# EAGLE board PDUv1 (EAGLE 9.6.2)
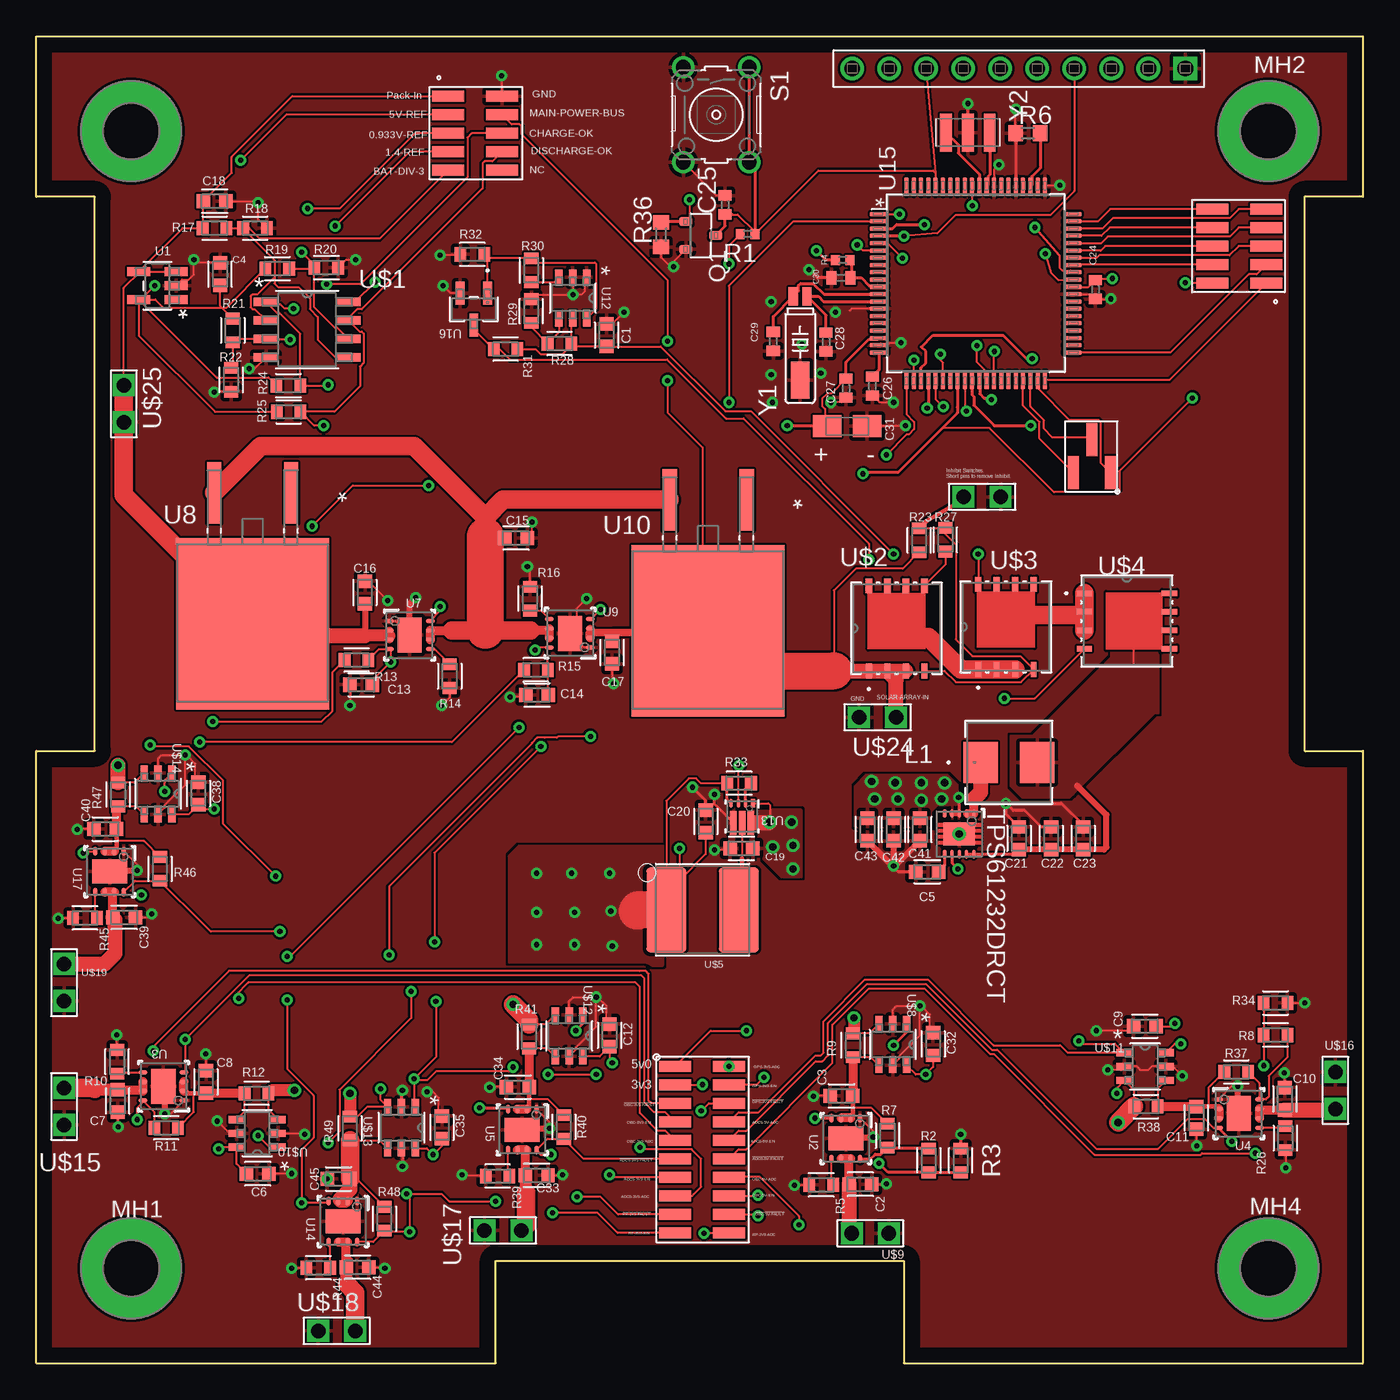
[diagram p4: board, top side]
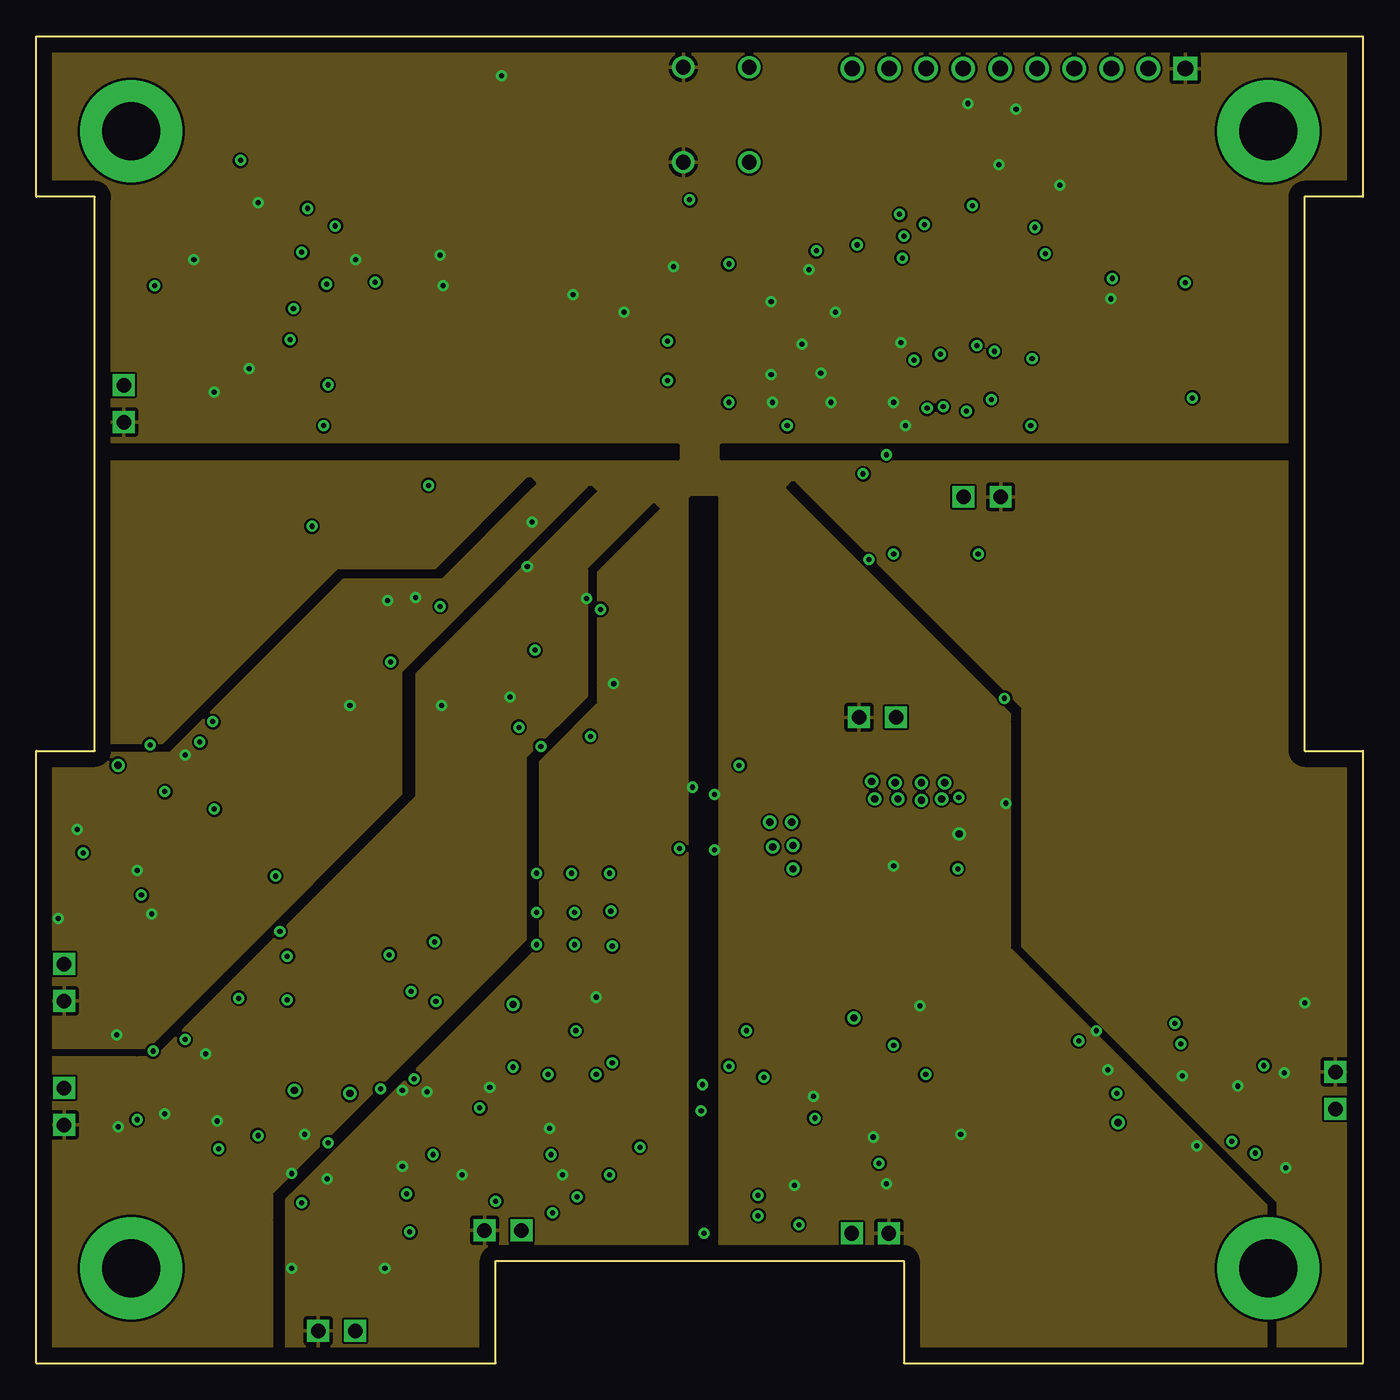
[diagram p5: board, inner layer GND]
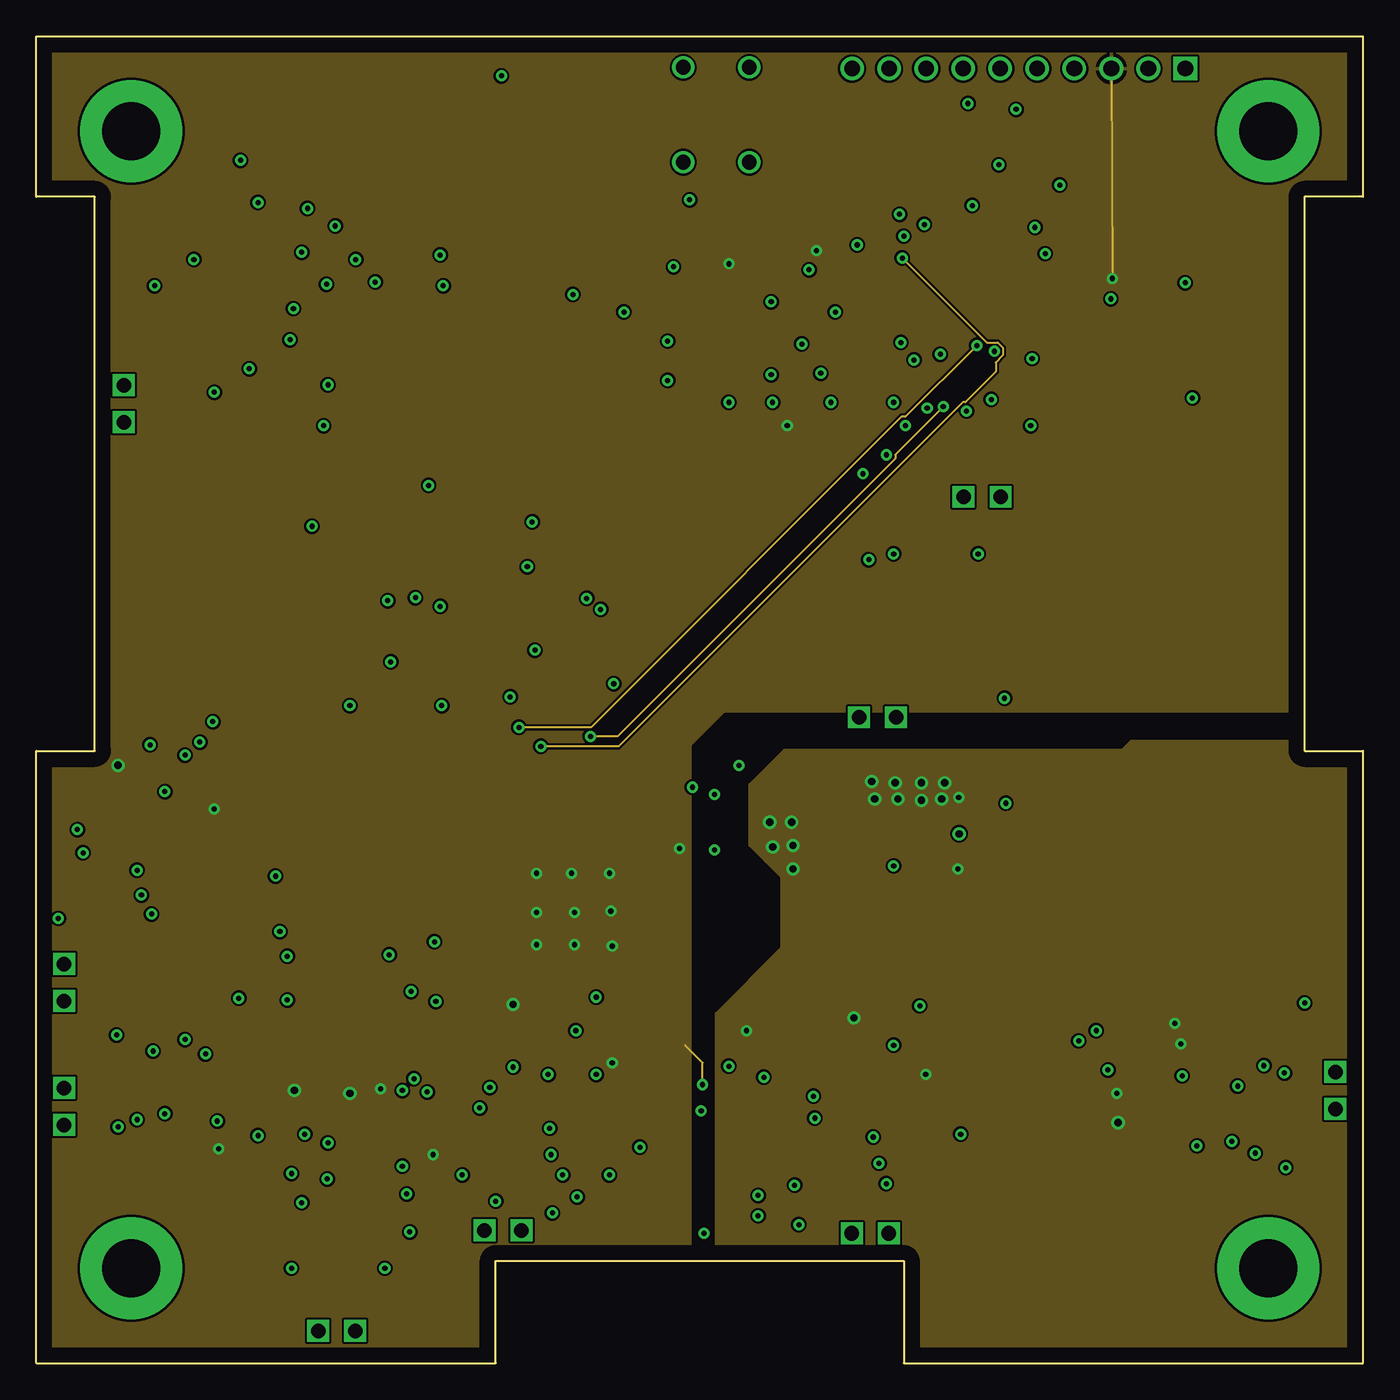
[diagram p6: board, inner layer POWER]
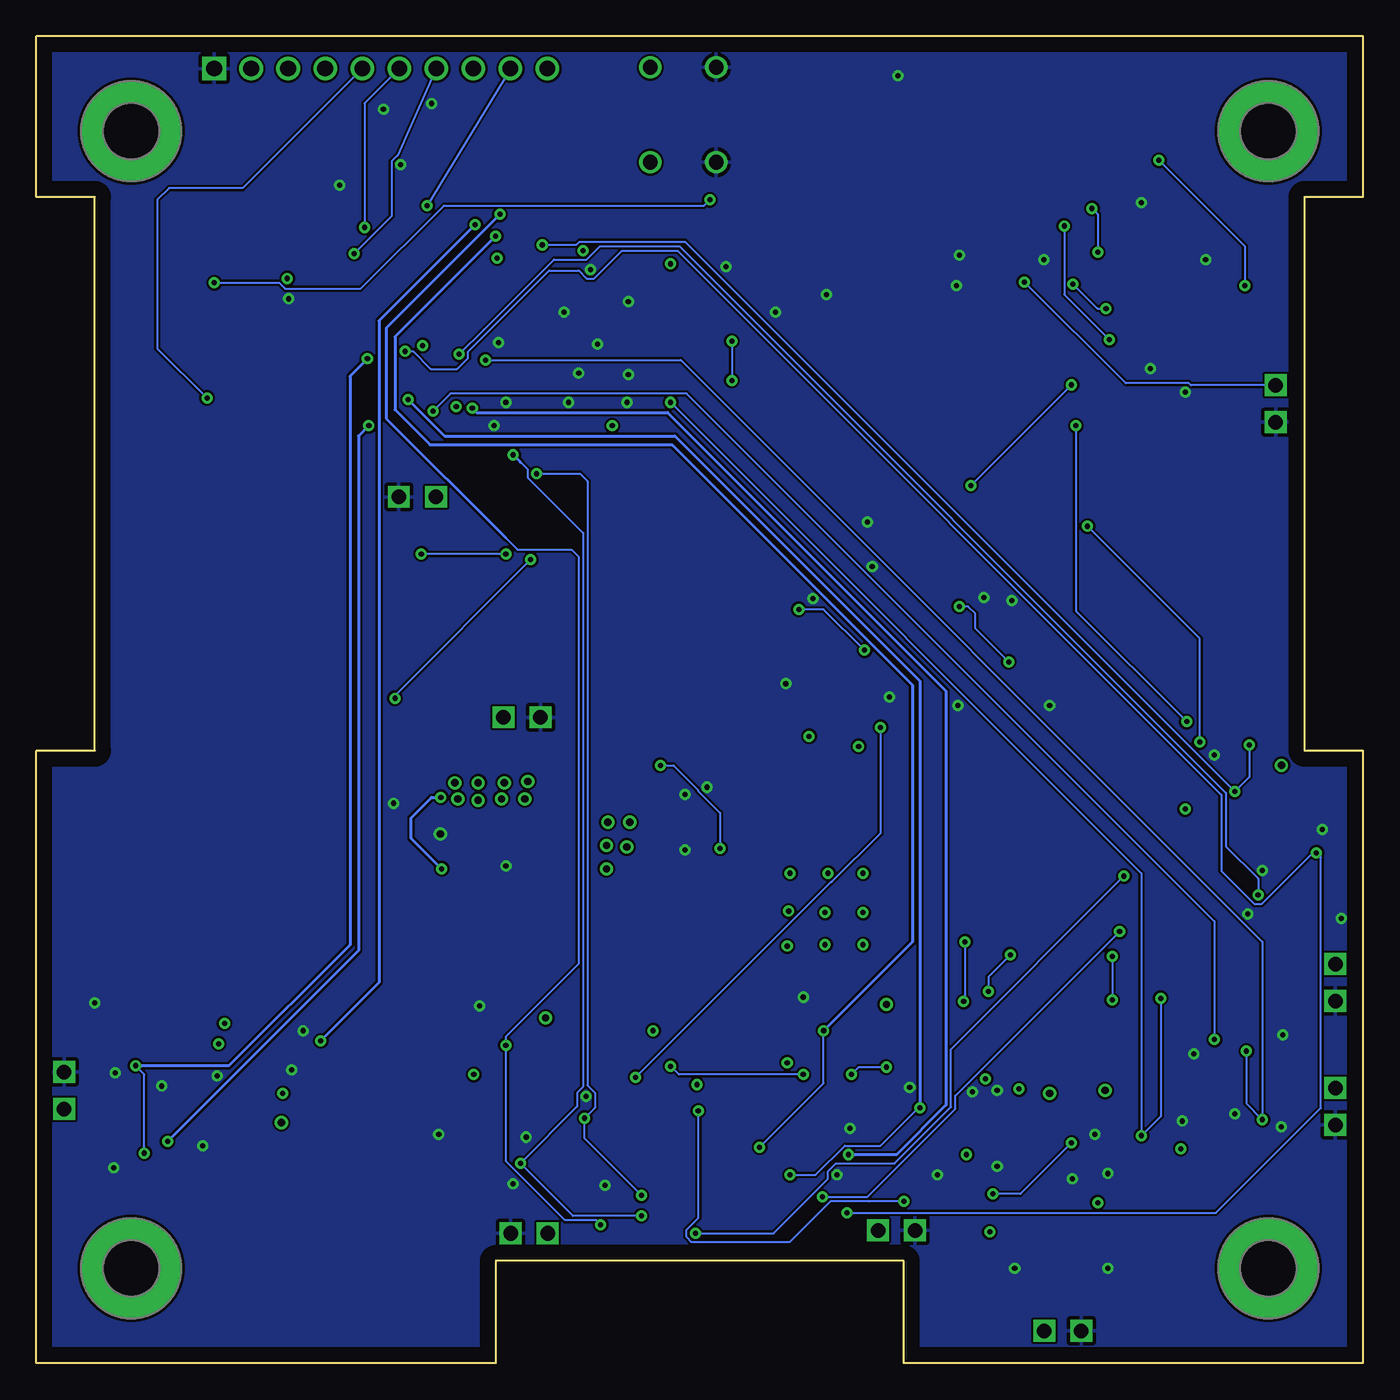
[diagram p7: board, bottom side, seen from below]

Size 91 x 91 mm. Coordinates in mm from the lower left corner, seen from the top.
Outline: 0,0 31.5,0 31.5,7 59.5,7 59.5,0 91,0 91,42 87,42 87,80 91,80 91,91 0,91 0,80 4,80 4,42 0,42 0,0
Copper layers (1+2*15+16): Top 0.035mm / dielectric 0.2mm / GND 0.035mm / dielectric 1mm / POWER 0.035mm / dielectric 0.2mm / Bottom 0.035mm
Design rules "default *": minimum track width 6mil, minimum drill 0.35mm, track to track 6mil, track to pad 6mil, pad to pad 6mil, via to via 6mil, smd to smd 6mil, copper to edge 40mil, drill to drill 6mil, minimum pad ring 10mil, minimum via ring 8mil, stop-mask expansion 4mil, vias tented up to drill 0mil, thermal gap 10mil
Net classes: 2 Power: width 0.203 mm, drill 0.305 mm, clearance 0.152 mm to class 0, clearance 0.152 mm to class 1, clearance 0.152 mm

## Footprints (pad centres in the part's own frame; a part is rotated, then mirrored left to right if it is on the bottom)
CAPC1608X85 = smd 0.921 x 0.97: 1 -0.775,0; 2 0.775,0
C0402 = smd 0.7 x 0.9: 1 -0.65,0; 2 0.65,0
A/3216-18R = smd 1.95 x 1.5: + 1.375,0; - -1.375,0
HDRV10W66P254_10X1_2540X254H858 = drill 1.08 pad 1.62 square: 1 0,0 | drill 1.08 pad 1.62: 2 2.54,0; 3 5.08,0; 4 7.62,0; 5 10.16,0; 6 12.7,0; 7 15.24,0; 8 17.78,0; 9 20.32,0; 10 22.86,0
IND_IHLP_2020_BZ_VIS-M = smd 2.362 x 2.794: 1 -1.943,0; 2 1.943,0
MTGP700H400 = drill 4 pad 7: 1 0,0
SOT23-3P95_230X110L20X43N_PMV16XN = smd 0.61 x 0.87: 1 -0.95,-1.02; 2 0.95,-1.02; 3 0,1.02
R0402 = smd 0.6 x 0.7: 1 -0.5,0; 2 0.5,0
RESC1608X60 = smd 0.799 x 0.974: 1 -0.815,0; 2 0.815,0
R0603 = smd 1 x 1.1: 1 -0.85,0; 2 0.85,0
B3F-10XX = drill 1.016: 1 -3.251,2.261; 2 3.251,2.261; 3 -3.251,-2.261; 4 3.251,-2.261
MF05A_TEX-M = smd 1.575 x 0.61: 1 -1.27,0.953; 2 -1.27,0; 3 -1.27,-0.953; 4 1.27,-0.953; 5 1.27,0.953
DRB0008B = smd 0.6 x 0.3: 1 -1.4,0.975; 2 -1.4,0.325; 3 -1.4,-0.325; 4 -1.4,-0.975; 5 1.4,-0.975; 6 1.4,-0.325; 7 1.4,0.325; 8 1.4,0.975 | smd 1.65 x 2.4: 9 0,0
D2PAK_STM-M = smd 0.991 x 4.216: 1 -2.64,-8.928; 3 2.64,-8.928 | smd 10.49 x 11.76: 2 0,0.051
DRC0010G = smd 0.6 x 0.24: 1 -1.4,1; 2 -1.4,0.5; 3 -1.4,0; 4 -1.4,-0.5; 5 -1.4,-1; 6 1.4,-1; 7 1.4,-0.5; 8 1.4,0; 9 1.4,0.5; 10 1.4,1 | smd 1.6 x 2.15: 11 0,0
TSOT-23_S6_LIT-M = smd 1.079 x 0.508: 1 -1.416,0.95; 2 -1.416,0; 3 -1.416,-0.95; 4 1.416,-0.95; 5 1.416,0; 6 1.416,0.95
RLT0007A = smd 0.6 x 0.25: 1 -0.9,0.75; 2 -0.9,0.25; 3 -0.9,-0.25; 4 -0.9,-0.75 | smd 1.64 x 0.44: 5 0.45,-0.6; 6 0.45,0; 7 0.45,0.6
QFP80P50_1400X1400X160L60X22N = smd 0.3 x 1.26: 1 -4.75,-6.63; 2 -4.25,-6.63; 3 -3.75,-6.63; 4 -3.25,-6.63; 5 -2.75,-6.63; 6 -2.25,-6.63; 7 -1.75,-6.63; 8 -1.25,-6.63; 9 -0.75,-6.63; 10 -0.25,-6.63; 11 0.25,-6.63; 12 0.75,-6.63; 13 1.25,-6.63; 14 1.75,-6.63; 15 2.25,-6.63; 16 2.75,-6.63; 17 3.25,-6.63; 18 3.75,-6.63; 19 4.25,-6.63; 20 4.75,-6.63; 41 4.75,6.63; 42 4.25,6.63; 43 3.75,6.63; 44 3.25,6.63; 45 2.75,6.63; 46 2.25,6.63; 47 1.75,6.63; 48 1.25,6.63; 49 0.75,6.63; 50 0.25,6.63; 51 -0.25,6.63; 52 -0.75,6.63; 53 -1.25,6.63; 54 -1.75,6.63; 55 -2.25,6.63; 56 -2.75,6.63; 57 -3.25,6.63; 58 -3.75,6.63; 59 -4.25,6.63; 60 -4.75,6.63 | smd 1.26 x 0.3: 21 6.63,-4.75; 22 6.63,-4.25; 23 6.63,-3.75; 24 6.63,-3.25; 25 6.63,-2.75; 26 6.63,-2.25; 27 6.63,-1.75; 28 6.63,-1.25; 29 6.63,-0.75; 30 6.63,-0.25; 31 6.63,0.25; 32 6.63,0.75; 33 6.63,1.25; 34 6.63,1.75; 35 6.63,2.25; 36 6.63,2.75; 37 6.63,3.25; 38 6.63,3.75; 39 6.63,4.25; 40 6.63,4.75; 61 -6.63,4.75; 62 -6.63,4.25; 63 -6.63,3.75; 64 -6.63,3.25; 65 -6.63,2.75; 66 -6.63,2.25; 67 -6.63,1.75; 68 -6.63,1.25; 69 -6.63,0.75; 70 -6.63,0.25; 71 -6.63,-0.25; 72 -6.63,-0.75; 73 -6.63,-1.25; 74 -6.63,-1.75; 75 -6.63,-2.25; 76 -6.63,-2.75; 77 -6.63,-3.25; 78 -6.63,-3.75; 79 -6.63,-4.25; 80 -6.63,-4.75
SOT-23_3L_ONS-M = smd 0.61 x 1.575: 1 -0.953,-1.092; 2 0.953,-1.092; 3 0,1.092
M08A-M = smd 1.664 x 0.559: 1 -2.826,1.905; 2 -2.826,0.635; 3 -2.826,-0.635; 4 -2.826,-1.905; 5 2.826,-1.905; 6 2.826,-0.635; 7 2.826,0.635; 8 2.826,1.905
MOSFET_65DP-T1-E3_VIS = smd 1.016 x 0.406: 1 -2.921,1.905; 2 -2.921,0.635; 3 -2.921,-0.635; 4 -2.921,-1.905; 5 2.921,-1.905; 6 2.921,-0.635; 7 2.921,0.635; 8 2.921,1.905
744040640047 = smd 2.76 x 5.83: 1 -2.485,0; 2 2.485,0
PREC002SAAN-RC = drill 1 square: 1 -1.27,0; 2 1.27,0
GRPB052VWQS-RC = smd 0.76 x 2.2: 1 0,0; 2 1.27,0; 3 2.54,0; 4 3.81,0; 5 5.08,0; 6 5.08,3.7; 7 3.81,3.7; 8 2.54,3.7; 9 1.27,3.7; 10 0,3.7
GRPB102VWQS-RC = smd 0.76 x 2.2: 1 0,0; 2 1.27,0; 3 2.54,0; 4 3.81,0; 5 5.08,0; 6 6.35,0; 7 7.62,0; 8 8.89,0; 9 10.16,0; 10 11.43,0; 11 11.43,3.7; 12 10.16,3.7; 13 8.89,3.7; 14 7.62,3.7; 15 6.35,3.7; 16 5.08,3.7; 17 3.81,3.7; 18 2.54,3.7; 19 1.27,3.7; 20 0,3.7
OBC-CON = smd 0.76 x 2.2: 1 0,0; 2 0,3.7; 3 1.27,0; 4 1.27,3.7; 5 2.54,0; 6 2.54,3.7; 7 3.81,0; 8 3.81,3.7; 9 5.08,0; 10 5.08,3.7
GRPB031VWTC-RC = smd 0.76 x 2.25: 1 0,0; 2 1.27,-2.25; 3 2.54,0
MS3V-T1R = smd 0.635 x 1.27: P1 -0.47,-4.43; P2 0.47,-4.43 | smd 1.27 x 2.54: P3 0,1.3
MURATA-FILTER_CSTCR = smd 0.8 x 2.6: 1 -1.5,0; 2 0,0; 3 1.5,0

## Placement (x,y rotation side)
C1  0.1u  [CAPC1608X85]  39.1,70.5 90 top
C2  47u  [CAPC1608X85]  56.52,12.27 0 top
C3  0.1u  [CAPC1608X85]  55.22,18.33 180 top
C4  0.022u  [CAPC1608X85]  12.6,74.7 270 top
C5  15n  [CAPC1608X85]  61.1,33.7 180 top
C6  0.1u  [CAPC1608X85]  15.18,12.99 0 top
C7  47u  [CAPC1608X85]  5.57,17.98 270 top
C8  0.1u  [CAPC1608X85]  11.63,19.28 90 top
C9  0.1u  [CAPC1608X85]  76.02,23.11 180 top
C10  47u  [CAPC1608X85]  85.63,18.12 90 top
C11  0.1u  [CAPC1608X85]  79.57,16.82 270 top
C12  0.1u  [CAPC1608X85]  39.31,22.48 90 top
C13  0.22u  [CAPC1608X85]  22.28,46.53 180 top
C14  0.22u  [CAPC1608X85]  34.33,45.83 180 top
C15  10u  [CAPC1608X85]  32.9,56.59 0 top
C16  0.1u  [CAPC1608X85]  22.53,52.86 90 top
C17  0.1u  [CAPC1608X85]  39.49,48.74 270 top
C18  1u  [CAPC1608X85]  12.22,79.69 0 top
C19  10u  [CAPC1608X85]  48.36,35.31 180 top
C20  10u  [CAPC1608X85]  45.91,37.16 90 top
C21  10u  [CAPC1608X85]  67.4,36 90 top
C22  10u  [CAPC1608X85]  69.6,36 90 top
C23  10u  [CAPC1608X85]  71.8,36 90 top
C24  100n  [C0402]  72.64,73.64 270 top
C25  1n  [C0402]  47.24,79.44 90 top
C26  470n  [C0402]  57.34,67.02 90 top
C27  100n  [C0402]  55.54,66.87 90 top
C28  12p  [C0402]  54.16,70.04 90 top
C29  12p  [C0402]  50.54,70.08 90 top
C30  100n  [C0402]  55.18,74.44 180 top
C31  10u  [A/3216-18R]  55.61,64.26 180 top
C32  0.1u  [CAPC1608X85]  61.51,21.88 90 top
C33  47u  [CAPC1608X85]  34.32,12.87 0 top
C34  0.1u  [CAPC1608X85]  33.02,18.93 180 top
C35  0.1u  [CAPC1608X85]  27.81,16.18 90 top
C38  0.1u  [CAPC1608X85]  11.11,39.08 90 top
C39  47u  [CAPC1608X85]  6.02,30.57 0 top
C40  0.1u  [CAPC1608X85]  4.72,36.63 180 top
C41  10u  [CAPC1608X85]  60.6,36.6 270 top
C42  10u  [CAPC1608X85]  58.8,36.6 270 top
C43  10u  [CAPC1608X85]  57,36.6 270 top
C44  47u  [CAPC1608X85]  22.02,6.57 0 top
C45  0.1u  [CAPC1608X85]  20.72,12.63 180 top
J5  HDR_10_EZFET_DEBUGGER  [HDRV10W66P254_10X1_2540X254H858]  78.81,88.8 180 top
L1  IHLP2020BZER1R0M01IND_IHLP_2020_BZ_VIS-M  [IND_IHLP_2020_BZ_VIS-M]  66.7,41.2 0 top
MH1  MTGP700H400  [MTGP700H400]  6.5,6.5 0 top
MH2  MTGP700H400  [MTGP700H400]  84.5,84.5 0 top
MH3  MTGP700H400  [MTGP700H400]  6.5,84.5 0 top
MH4  MTGP700H400  [MTGP700H400]  84.5,6.5 0 top
Q1  PMV16XN  [SOT23-3P95_230X110L20X43N_PMV16XN]  45.57,77.35 270 top
R1  47k  [R0402]  48.78,77.44 180 top
R2  100k  [RESC1608X60]  61.2,13.9 90 top
R3  196k  [RESC1608X60]  63.4,13.9 270 top
R4  0R  [R0402]  55.3,75.66 180 top
R5  54.9k  [RESC1608X60]  53.83,12.23 0 top
R6  1M  [R0603]  68.01,84.36 0 top
R7  100k  [RESC1608X60]  58.37,15.6 90 top
R8  100k  [RESC1608X60]  85,22.5 0 top
R9  40m  [RESC1608X60]  56,21.8 90 top
R10  54.9k  [RESC1608X60]  5.53,20.67 270 top
R11  100k  [RESC1608X60]  8.9,16.13 0 top
R12  40m  [RESC1608X60]  15.1,18.5 0 top
R13  100k  [RESC1608X60]  21.96,48.23 0 top
R14  20k  [RESC1608X60]  28.35,47.12 90 top
R15  100k  [RESC1608X60]  34.26,47.55 0 top
R16  20k  [RESC1608X60]  33.87,52.44 270 top
R17  340k  [RESC1608X60]  12.22,77.85 180 top
R18  169k  [RESC1608X60]  15,77.85 180 top
R19  1.62M  [RESC1608X60]  16.52,75.07 180 top
R20  374k  [RESC1608X60]  19.88,75.15 180 top
R21  1.43M  [RESC1608X60]  13.47,70.83 90 top
R22  562k  [RESC1608X60]  13.35,67.44 90 top
R23  499k  [RESC1608X60]  60.55,56.44 270 top
R24  332k  [RESC1608X60]  17.28,67.05 180 top
R25  332k  [RESC1608X60]  17.3,65.25 180 top
R26  54.9k  [RESC1608X60]  85.67,15.43 90 top
R27  499k  [RESC1608X60]  62.35,56.48 270 top
R28  1Meg  [RESC1608X60]  35.88,69.93 0 top
R29  392k  [RESC1608X60]  33.95,72.16 270 top
R30  715k  [RESC1608X60]  33.95,74.96 90 top
R31  499k  [RESC1608X60]  32.18,69.55 0 top
R32  100k  [RESC1608X60]  29.9,76.05 0 top
R33  1M  [RESC1608X60]  48.2,39.77 0 top
R34  196k  [RESC1608X60]  85,24.7 180 top
R36  10k  [R0603]  42.84,77.4 90 top
R37  100k  [RESC1608X60]  82.3,19.97 180 top
R38  40m  [RESC1608X60]  76.1,17.6 180 top
R39  54.9k  [RESC1608X60]  31.63,12.83 0 top
R40  100k  [RESC1608X60]  36.17,16.2 90 top
R41  40m  [RESC1608X60]  33.8,22.4 90 top
R44  54.9k  [RESC1608X60]  19.33,6.53 0 top
R45  54.9k  [RESC1608X60]  3.33,30.53 0 top
R46  100k  [RESC1608X60]  8.47,33.9 90 top
R47  40m  [RESC1608X60]  5.6,39 90 top
R48  100k  [RESC1608X60]  23.87,9.9 90 top
R49  40m  [RESC1608X60]  21.5,16.1 90 top
S1  RST  [B3F-10XX]  46.63,85.63 270 top
U1  LM4120IM5-5.0/NOPBMF05A_TEX-M  [MF05A_TEX-M]  8.3,73.9 180 top
U2  Value  [DRB0008B]  55.52,15.41 270 top
U3  Value  [DRB0008B]  8.71,18.98 180 top
U4  Value  [DRB0008B]  82.49,17.12 0 top
U5  Value  [DRB0008B]  33.32,16.01 270 top
U7  Value  [DRB0008B]  25.61,49.94 0 top
U8  STPS10L25G-TRD2PAK_STM-M  [D2PAK_STM-M]  14.83,50.77 180 top
U9  Value  [DRB0008B]  36.59,50.06 180 top
U10  STPS10L25G-TRD2PAK_STM-M  [D2PAK_STM-M]  46.07,50.29 180 top
U11  TPS61232DRCT  [DRC0010G]  63.3,36.3 270 top
U12  LTC6995IS6-1TRMPBFTSOT-23_S6_LIT-M  [TSOT-23_S6_LIT-M]  36.79,73.06 270 top
U13  TPS62086RLTR  [RLT0007A]  48.4,37.5 270 top
U14  Value  [DRB0008B]  21.02,9.71 270 top
U15  MSP430F5529IPN  [QFP80P50_1400X1400X160L60X22N]  64.43,74.07 270 top
U16  BSS138SOT-23_3L_ONS-M  [SOT-23_3L_ONS-M]  30,72.3 180 top
U17  Value  [DRB0008B]  5.02,33.71 270 top
U$1  LM393M  [M08A-M]  18.57,70.89 0 top
U$2  SI7461DP-T1-E3  [MOSFET_65DP-T1-E3_VIS]  59,50.4 90 top
U$3  SI7461DP-T1-E3  [MOSFET_65DP-T1-E3_VIS]  66.5,50.5 90 top
U$4  SI7461DP-T1-E3  [MOSFET_65DP-T1-E3_VIS]  74.8,50.9 0 top
U$5  744040640047  [744040640047]  45.69,31.09 0 top
U$7  PREC002SAAN-RC  [PREC002SAAN-RC]  64.87,59.42 0 top
U$8  INA181A2QDBVRQ1CT  [TSOT-23_S6_LIT-M]  58.74,21.85 270 top
U$9  PREC002SAAN-RC  [PREC002SAAN-RC]  57.2,8.9 180 top
U$10  INA181A2QDBVRQ1CT  [TSOT-23_S6_LIT-M]  15.15,15.76 180 top
U$11  INA181A2QDBVRQ1CT  [TSOT-23_S6_LIT-M]  76.05,20.34 0 top
U$12  INA181A2QDBVRQ1CT  [TSOT-23_S6_LIT-M]  36.54,22.45 270 top
U$13  INA181A2QDBVRQ1CT  [TSOT-23_S6_LIT-M]  25.04,16.15 270 top
U$14  INA181A2QDBVRQ1CT  [TSOT-23_S6_LIT-M]  8.34,39.05 270 top
U$15  PREC002SAAN-RC  [PREC002SAAN-RC]  1.9,17.6 90 top
U$16  PREC002SAAN-RC  [PREC002SAAN-RC]  89.1,18.7 270 top
U$17  PREC002SAAN-RC  [PREC002SAAN-RC]  32,9.1 0 top
U$18  PREC002SAAN-RC  [PREC002SAAN-RC]  20.6,2.2 0 top
U$19  PREC002SAAN-RC  [PREC002SAAN-RC]  1.9,26.1 90 top
U$20  GRPB052VWQS-RC  [GRPB052VWQS-RC]  28.24,86.9 270 top
U$21  GRPB102VWQS-RC  [GRPB102VWQS-RC]  43.8,20.36 270 top
U$22  OBC-CONNECTOR  [OBC-CON]  84.36,74.08 90 top
U$23  GRPB031VWTC-RC  [GRPB031VWTC-RC]  73.66,61.09 180 top
U$24  PREC002SAAN-RC  [PREC002SAAN-RC]  57.7,44.3 180 top
U$25  PREC002SAAN-RC  [PREC002SAAN-RC]  6,65.8 270 top
Y1  32.768kHz  [MS3V-T1R]  52.39,68.74 180 top
Y2  CSTCR4M00G15L99  [MURATA-FILTER_CSTCR]  63.89,84.41 0 top

## Tracks (layer width: path | path; a pad name or v marks a point on that pad's centre or on a via)
0.933V-REF  (via drill 0.35)
  Top 0.152: R19.1 18.98,75.07 R20.2 | U$20.3 25.96,84.36 20.8,79.2 v18.6,79.2 | v18.2,76.2 19.07,75.33 R20.2 | U$1.6 20.63,71.02 20.47,71.02 19.07,72.42 R20.2
  Bottom 0.152: v18.6,79.2 18.2,78.8 v18.2,76.2
1.4V-REF  (via drill 0.35)
  Top 0.152: R22.2 13.47,68.38 R21.1 13.71,70.25 U$1.3 15.8,70.2 v17.4,70.2 | U$20.4 25.59,83.09 v20.5,78
  Bottom 0.152: v20.5,78 20.5,73.3 v17.4,70.2
3V3  (via drill 0.35, 0.5)
  Top 0.152: C6.1 13.73,13.66 U$10.6 12.61,14.81 v12.5,14.7 | U$10.3 15.91,17.36 R12.2 | U$14.6 10.44,37.63 C38.1 11.41,38 v12.2,38 | U$14.3 6.74,39.81 R47.2 | U15.50 72.17,73.82 C24.1 72.75,74.4 v73.8,74.4 | v39.5,20.6 39.31,20.79 C12.1 38.64,21.03 U$12.6 | C20.1 45.91,34.91 44.1,33.1 | U13.3 48.15,40.95 v48.2,41 | v44.1,35.3 44.1,33.1 | 44.1,33.1 43.7,32.7 | R1.2 47.5,76.66 v47.5,75.4 | C27.2 54.53,66.51 54.25,66.51 53.89,66.15 53.89,65.65 54.1,65.44 54.1,64.26 | U$5.1 43.2,38.56 44.75,40.11 45.25,40.11 45.59,39.77 R33.1 | U$21.2 v45.69,19.09 v45.7,19.1 | v23.6,18.8 23.6,18.06 U$13.3 22.67,17.57 22.02,16.91 R49.2 | U$13.6 26.77,14.73 v27.2,14.3 27.81,14.91 C35.1 | U$12.3 34.94,23.21 R41.2
  Top 0.203: U15.18 57.7,70.22 57.11,70.22 55.54,68.65 C27.2 | C31.+ 54.1,64.26 51.54,64.26 v51.5,64.3 | R4.2 54.14,75.66 v53.5,76.3 | U13.4 47.38,38.66 R33.1
  Top 0.813: v17.7,18.7 16.11,18.7 R12.2 | v21.5,18.5 R49.2
  Top 1.016: R47.2 v5.6,41
  Top 1.27: R41.2 33.8,23.5 v32.7,24.6
  Top 2.54: U$5.1 41.29,31.09 41.2,31
  POWER 0.152: v45.7,19.1 45.7,20.6 44.5,21.8 | J5.3 v73.8,74.4
  Bottom 0.152: v48.2,41 47.3,41 45.61,39.31 45.61,39.25 44.1,37.74 v44.1,35.3
  other vias: 34.3,33.6 36.7,33.6 39.3,33.6 34.3,30.9 36.9,30.9 39.4,31 34.3,28.7 36.9,28.7 39.5,28.6
  pour Top (isolate 0.406): 43,35.5 43,27.3 42.9,27.2 32.7,27.2 32.4,27.5 32.4,34.8 33.1,35.5
  pour POWER: -0.6,91.7 -0.6,-0.5 -0.1,-1 44.8,-1 44.9,-0.9 44.9,42.4 45,42.5 47.2,44.7 52.3,44.7 91.4,44.7 91.4,91.6 91.5,91.7
3V3-ADCS
  Top 0.152: 33.55,14.51 U5.7 | 33.6,12.81 C33.1
  Top 0.61: U5.7 U5.6 | C33.1 33.55,14.51
  Top 0.813: C33.1 33.55,11.76 33.6,11.7
  Top 1.27: 33.6,11.7 33.6,9.43 U$17.2
3V3-GPS
  Top 0.152: 21.25,6.86 C44.1 21.34,6.67
  Top 0.61: U14.6 U14.7 21.25,8.21 C44.1
  Top 0.813: 21.25,6.86 21.34,6.95 | C44.1 21.25,5.46 21.3,5.4
  Top 1.27: 21.3,5.4 21.87,4.83 U$18.2
3V3-OBC
  Top 0.152: 7.21,18.75 U3.7 | 5.6,18.86 5.7,18.75
  Top 0.61: U3.7 U3.6 | C7.1 5.7,18.75 7.21,18.75 | 5.6,18.86 4.93,18.86
  Top 0.813: C7.1 4.04,18.75 4,18.8
  Top 1.27: 4,18.8 3.93,18.87 U$15.2
3V3-RF
  Top 0.152: 5.25,32.21 U17.7
  Top 0.61: U17.7 U17.6 | C39.1 5.25,32.21
  Top 1.016: U$19.2 4.67,27.37 5.4,28.1 5.4,30.41 C39.1
5V0  (via drill 0.35, 0.5)
  Top 0.152: U$8.3 57.14,22.61 R9.2 55.9,22.71 | R38.2 75.28,18.74 U$11.3 74.1,18.86 v74.1,18.5 | U$21.1 46.24,22.8 v48.7,22.8 | C9.1 77.91,23.11 v78.1,23.3 | v78.5,21.9 78.08,21.9 U$11.6 | C32.1 61.51,20.31 v61,19.8 60.32,19.8 U$8.6 | U13.1 50.2,38.4 50.3,38.3 v50.3,37.1
  Top 0.2: U11.7 62.8,34.3 v63.2,33.9 | v63.26,38.8 63.26,37.74 63.22,37.7
  Top 0.203: v50.3,37.1 50.25,37.05
  Top 0.406: 63.22,37.7 U11.4
  Top 0.813: v56.07,23.67 56.07,22.69 R9.2
  Top 1.016: 50.25,37.05 49.28,37.05
  Top 1.27: R38.2 74.2,16.52 v74.2,16.5
  Bottom 0.2: v63.2,33.9 65.3,36 65.3,37.4 63.9,38.8 v63.26,38.8
  other vias: 51.8,37.1 50.5,35.4 51.9,35.5 51.9,33.9 57.3,39.9 59.1,38.7 58.9,39.8 57.5,38.7 60.7,38.6 60.7,39.8 62.1,38.7 62.3,39.8
  pour Top (isolate 0.406): 50.4,37.9 49.1,37.9 48.8,37.6 48.8,36.2 48.4,35.8 48.2,35.8 48.1,35.7 48.1,34.6 49.8,34.6 51.1,33.3 52.5,33.3 52.5,37.9 52.4,38 50.5,38
  pour POWER (rank 2): 46.6,-0.4 46.6,24 51.1,28.5 51.1,33.3 50,34.4 48.9,35.5 48.9,38.1 48.9,39.7 51.3,42.1 74.5,42.1 75.1,42.7 91.7,42.7 91.7,0.2 90.8,-0.7 46.9,-0.7
  pour Top: 63.2,38.8 63.2,38.3 63.3,38.2 63.3,37.3 62.8,37.3 62.8,38.2 61.8,38.2 61.7,38.1 61.4,37.8 61.4,36.7 56.2,36.7 56.1,36.8 56.1,39.6 56.9,40.4 62.5,40.4 62.9,40 63.2,39.7
5V-ADCS
  Top 0.152: 83.99,17.34 U4.7
  Top 0.61: U4.7 U4.6 | C10.1 83.99,17.34
  Top 1.016: U$16.2 89.02,17.34 C10.1
5V-OBC
  Top 0.152: 55.74,13.91 U2.7
  Top 0.61: U2.7 U2.6 | C2.1 55.74,13.91
  Top 1.016: C2.1 55.74,9.09 U$9.2
5V-REF  (via drill 0.35)
  Top 0.152: U1.5 8.15,72.95 8.69,72.41 12.7,72.41 | 12.7,72.41 13.05,72.41 R19.2 | 12.7,72.41 R21.2 | 12.7,72.41 12.6,72.52 C4.2 | U1.5 12.38,67.6 15.91,67.6 R24.2 | U1.5 7.03,70.47 12.25,65.25 R25.2 | U$20.2 17.13,85.63 v14,82.5 | v8.1,73.9 7.15,72.95 U1.5
  Bottom 0.152: v14,82.5 8.1,76.6 v8.1,73.9
!ADCS-3V3-FAULT  (via drill 0.35)
  Top 0.152: U5.8 35.07,15.38 R40.1 37.55,14.01 U$21.6
  Top 0.2: U15.24 61.18,65.58 v61.1,65.5 | v35.3,14.3 34.6,14.3 U5.8
  Bottom 0.2: v61.1,65.5 60.8,65.2 47.7,65.2 28.6,46.1 28.6,17.7 32,14.3 v35.3,14.3
!ADCS-5V-FAULT  (via drill 0.35)
  Top 0.152: U$21.15 48.16,14.67 48.7,14.67 54.6,20.58 54.6,23.2 57.1,25.7 60.9,25.7 65.41,21.2 65.67,21.2 72.58,14.29 79.85,14.29 79.96,14.4 v83.6,14.4 | R34.2 R8.1 84.2,22.48 v84.2,20.4
  Top 0.2: U15.23 60.68,68.28 61,68.6 61,69.4 60.7,69.7 61.5,70.5 66.3,70.5 67.9,68.9 v68.3,68.9
  Bottom 0.152: v83.6,14.4 83.6,19.8 v84.2,20.4
  Bottom 0.2: v68.3,68.9 69.5,67.7 69.5,28.7 77.8,20.4 v84.2,20.4
!GPS-3V3-FAULT  (via drill 0.35)
  Top 0.152: R48.1 23.79,9 | 23.79,9 23.09,8.31 U14.8 | U15.25 61.68,66.12 v62.2,65.6 | 23.79,9 v25.6,9 25.6,11.4 v25.4,11.6 27.8,11.6 28.3,11.1 v31.5,11.1 | v45.6,17.3 46.12,17.82 U$21.18 | v38,42.99 35.79,42.99 35.7,42.9 34.86,42.9 34.85,42.91 34.35,42.91 33.99,42.55 33.99,42.49 24.2,32.7 v24.2,28 | v20,15.1 20.78,15.88 20.78,18.75 25.7,23.66 v25.7,25.49
  POWER 0.152: v62.2,65.6 58.91,62.31 58.91,62.05 39.85,42.99 v38,42.99
  Bottom 0.152: v24.2,28 25.7,26.5 v25.7,25.49 | v20,15.1 23.5,11.6 v25.4,11.6 | v31.5,11.1 33.87,11.1 33.89,11.09 36.54,11.09 39.33,8.29 46.05,8.29 46.41,8.65 46.41,9.15 45.6,9.96 v45.6,17.3
!OBC-3V3-FAULT  (via drill 0.35)
  Top 0.152: U3.8 7.36,17.96 | 7.36,17.96 8.09,17.23 R11.1 | U15.22 60.18,68.78 v60.2,68.8 | v6.9,16.7 6.9,17.5 7.36,17.96 | U$21.3 42.18,17.82 42,18 42,26.7 41.8,26.9 41.4,26.9 41.4,26.91 13.21,26.91 8,21.7 v8,21.4
  Bottom 0.152: v60.2,68.8 46.8,68.8 6.9,28.9 v6.9,16.7 8,17.8 v8,21.4
!OBC-5V-FAULT  (via drill 0.35)
  Top 0.152: U$21.12 49.4,10.2 v49.5,10.1 | U15.21 59.68,65.08 60.21,64.55 60.21,64.05 59.85,63.69 59.69,63.69 v58.3,62.3
  Top 0.2: v57.8,13.7 58.41,13.09 R2.1 R3.2
  Bottom 0.152: v49.5,10.1 54.2,10.1 v57.8,13.7 53.91,17.59 53.91,18.55 53.51,18.95 53.51,56.95 57.31,60.75 57.31,61.31 57.8,61.8
  Bottom 0.2: v58.3,62.3 57.8,61.8
!RF-3V3-FAULT  (via drill 0.35)
  Top 0.152: U15.26 62.18,68.62 62,68.8 v62,69.2 | v7.2,32.1 6.21,32.1 U17.8 6.77,33.09 R46.1 11.43,30.13 11.96,29.6 v16.7,29.6 | 43.7,10.1 U$21.9 39.9,10.2 38.71,11.39 v37.09,11.39
  Bottom 0.152: v62,69.2 60.3,70.9 55.51,75.69 53.25,75.69 52.34,76.6 46.9,76.6 9.41,39.11 9.41,35.45 7.2,33.24 v7.2,32.1 | v16.7,29.6 27.97,18.33 27.97,17.44 34.01,11.39 v37.09,11.39
ADCS-3V3-
  Top 0.152: U$12.4 35.04,21.59 R41.1 | C34.1 | 33.8,17.56 U5.2 | R40.2 35.09,18.1 33.8,18.1
  Top 0.305: C34.1 33.8,18.1 33.8,17.56
  Top 0.61: R41.1 C34.1 | U5.2 U5.3
ADCS-3V3-ADC  (via drill 0.35)
  Top 0.152: U$21.8 44.97,11.47 45.6,12.1 45.6,14.01 44.94,14.67 41.53,14.67 v41.4,14.8 | v59.5,77.3 61.8,77.5 63.04,78.74 69.54,78.74 71.19,80.39 J5.4
  Top 0.2: U15.4 59.48,77.32 v59.5,77.3 | v37,22.8 37.49,23.29 U$12.1
  Bottom 0.152: v41.4,14.8 37,19.2 v37,22.8
  Bottom 0.2: v59.5,77.3 66.4,70.4 66.4,65.4 64,63 47.4,63 30.9,46.5 30.9,28.9 v37,22.8
ADCS-3V3-EN  (via drill 0.35)
  Top 0.152: U$21.7 39.46,12.74 v39.3,12.9
  Top 0.2: U15.31 64.7,67.42 64.7,66.5 65,66.2 65.4,66.2 v65.5,66.1 | v30.4,17.5 32.26,17.5 U5.4
  Bottom 0.152: v39.3,12.9 37.56,12.9 35.55,14.91 33.09,14.91 30.4,17.6
  Bottom 0.2: v65.5,66.1 63,63.6 47.2,63.6 30.4,46.8 30.4,17.6 v30.4,17.5
ADCS-5V-
  Top 0.152: U$11.4 76.92,18.84 R38.1 | C11.1 | 80.94,17.59 U4.2 | R37.2 80.4,18.89 80.4,17.59
  Top 0.305: C11.1 80.4,17.59 80.94,17.59
  Top 0.61: R38.1 C11.1 | U4.2 U4.3
ADCS-5V-ADC  (via drill 0.35)
  Top 0.152: U$21.17 48.16,17.21 49.53,17.21 53.42,21.1 53.8,21.1 53.99,21.29 53.99,23.45 56.85,26.31 61.15,26.31 65.66,21.8 70.23,21.8 70.74,21.29 74.6,21.29 | U$11.1 74.6,21.29 | v71.5,22.1 71.7,21.9 73.99,21.9 74.6,21.29
  Top 0.2: U15.3 58.72,77.82 59,78.1 v60.9,78.1
  Bottom 0.2: v60.9,78.1 67.5,71.5 67.5,26.1 v71.5,22.1
ADCS-5V-EN  (via drill 0.35)
  Top 0.152: U$21.16 48.16,15.94 48.7,15.94 53.45,20.7 53.9,20.7 54.3,21.09 54.3,23.33 56.97,26 61.03,26 65.53,21.5 65.9,21.5 72.7,14.7 76.96,14.7 78.99,16.73 80.15,16.73 80.74,16.14 U4.4
  Top 0.2: U15.30 64.18,66.42 64.3,66.3 64.3,65.7 65.7,64.3 v68.2,64.3 | v82,15.2 81.09,16.11 U4.4
  Bottom 0.2: v68.2,64.3 68.9,63.6 68.9,28.3 v82,15.2
AVCC1
  Top 0.203: U15.11 57.7,73.92 57.11,73.92 56.59,74.44 55.9,74.44 | C30.1 55.9,74.44 | R4.1 55.9,75.56 55.9,74.44
BAT-DIV-3
  Top 0.152: R17.1 R18.2 | 16.33,74.49 16.33,75.65 14.19,77.8 R18.2 | U$1.2 14.98,72.29 14.82,72.29 14.68,72.42 14.68,73.17 14.82,73.3 15.15,73.3 16.33,74.49 | R18.2 14.61,77.85 15.32,77.13 23.55,77.13 U$20.5 | 16.33,74.49 16.33,74.05 16.58,73.8 18,73.8 18.76,73.04 18.76,72.3 19.3,71.75 19.3,70.2 20.52,68.98 U$1.5
CHARGE-OK  (via drill 0.35)
  Top 0.152: 15.92,72.62 16.51,72.03 16.67,72.03 18.09,70.61 R24.1 19.95,67.05 v20,67.1 | 15.92,72.62 U$1.1 | U$20.8 29.86,84.36 29.57,84.07 29.57,81.34 22.22,74 v19.89,74 | v17.63,72.33 17.03,72.33 16.74,72.62 15.92,72.62 | 33.14,47.24 R15.1 28.5,42.6 v11.2,42.6 | v18.9,57.4 21.7,60.2 v26.9,60.2
  Bottom 0.152: v19.89,74 18.22,72.33 v17.63,72.33 | v20,67.1 v26.9,60.2 | v11.2,42.6 11.2,49.7 v18.9,57.4
DISCHARGE-OK  (via drill 0.35)
  Top 0.152: 20.9,71.6 21.32,71.6 | 21.32,71.6 U$1.7 22.16,70.76 22.32,70.76 22.46,70.63 22.46,68.61 22.2,68.36 22.2,67 20.45,65.25 R25.1 19.07,64.3 v19.7,64.3 | U$20.7 31.28,82.43 30.75,82.43 30.61,82.3 30.61,80.58 22.32,72.29 22.01,72.29 21.32,71.6 | R13.1 20.3,47.39 20.3,44.74 19.56,44 v12.1,44
  Bottom 0.152: v19.7,64.3 19.7,51.6 v12.1,44
GND  (via drill 0.35, 0.5)
  Top 0.152: C3.2 53.33,18.33 v53.3,18.3 | U$8.2 58.74,24.24 59,24.5 v60.6,24.5 | C32.2 61.3,22.86 61.3,23.9 60.7,24.5 v60.6,24.5 | U2.1 57.4,15.9 v57.4,15.5 | U2.9 55.61,15.5 | U$8.5 59.21,20.9 59.21,21.07 60.6,22.46 v60.6,24.5 | R5.1 52.98,12.2 v52,12.2 | C2.2 58.27,12.27 v58.3,12.3 | C8.2 11.63,21.17 v11.6,21.2 | 16.16,13.2 C6.2 15.96,13 v17.5,13 | U3.1 9.21,17.1 v8.8,17.1 | U3.9 8.8,18.89 | R10.1 5.5,21.52 v5.5,22.5 | C7.2 5.57,16.23 v5.6,16.2 | C11.2 79.57,14.93 v79.6,14.9 | 75.03,22.9 C9.2 74.94,22.8 v72.7,22.8 | U4.1 82,19 v82.4,19 | U4.9 82.4,17.21 | R26.1 85.7,14.59 v85.7,13.4 | C10.2 85.63,19.87 v85.6,19.9 | C34.2 31.13,18.93 v31.1,18.9 | U$12.2 36.54,24.84 36.8,25.1 v38.4,25.1 | C12.2 39.1,23.46 39.1,24.5 38.5,25.1 v38.4,25.1 | U5.1 35.2,16.5 v35.2,16.1 | U5.9 33.41,16.1 | U$12.5 37.01,21.5 37.01,21.67 38.4,23.06 v38.4,25.1 | 30.79,12.8 R39.1 29.27,12.83 v29.2,12.9 | C33.2 36.07,12.87 v36.1,12.9 | C35.2 27.6,17.16 27.6,18.2 27.2,18.6 v26.8,18.6 | C40.2 2.83,36.63 v2.8,36.6 | U$14.2 8.34,41.44 8.6,41.7 v10.2,41.7 | C38.2 10.9,40.06 10.9,41.1 10.3,41.7 v10.2,41.7 | U17.1 6.9,34.2 v6.9,33.8 | U17.9 5.11,33.8 | U$14.5 8.81,38.1 8.81,38.27 10.2,39.66 v10.2,41.7 | R45.1 2.48,30.5 v1.5,30.5 | C39.2 7.67,30.57 v7.9,30.8 | C1.2 39.48,71.28 v40.3,72.1 | 13.07,79.69 C18.2 15.11,79.69 v15.2,79.6 15.2,78.47 R18.1 | U15.49 72.31,73.32 C24.2 v73.69,72.99 v73.7,73 | R6.1 67.16,85.96 v67.2,86 | U15.61 69.28,80.8 v70.2,80.8 | U15.68 65.68,81.33 65.72,81.36 65.72,81.9 v66.02,82.2 | v78.6,19.7 77.96,20.34 U$11.5 76.5,20.34 76.25,20.09 75.75,20.09 75.5,20.34 U$11.2 74.39,20.1 v73.5,20.1 | U$10.2 18.34,15.76 v18.4,15.7 | U$10.5 13.24,15.76 v12.4,16.6
  Top 0.152: U$20.10 31.94,88.26 v31.9,88.3 | U16.2 28.41,73.39 v27.9,73.9 | R32.1 29.04,76 v27.7,76 | U12.2 36.8,74.47 v36.8,73.3 | U12.1 37.6,74.34 37.6,73.5 37.4,73.3 v36.8,73.3 | R29.1 34.27,73.3 v36.8,73.3 | C15.2 34,56.91 v34,57.7 | C16.2 22.77,53.63 v24.1,52.3 | C13.2 v21.5,45.1 | R36.1 42.84,75.86 43.5,75.2 v43.7,75.2 43.7,75.55 Q1.2 | C25.2 46.66,80.09 S1.4 | R20.1 21.25,75.7 v21.9,75.7 | C27.1 55.22,65.9 v54.5,65.9 | U7.1 24.64,50.91 U7.9 | R14.1 28.35,45.65 v27.8,45.1 | C14.2 33.42,45.7 v32.5,45.7 | C17.2 39.49,46.71 v39.6,46.6 | R16.1 33.87,54.43 v33.67,54.63 | v37.75,52.45 37.07,51.78 37.07,50.81 36.59,50.33 U9.9 37.56,49.09 U9.1 | U1.2 9.99,74.32 10.45,74.32 10.8,74.67 v10.8,75.7 11.03,75.47 C4.1 | U15.19 57.92,69.94 58.48,69.94 58.54,70 v59.3,70 | U15.14 55.92,72.32 55.8,72.2 | U$1.4 14.97,68.21 v14.6,68.21 | R22.1 12.22,66.62 v12.2,66.6 | C19.2 47.48,35.2 v46.52,35.2 | C26.1 57.81,65.9 v58.8,65.9 | C31.- 57.02,64.3 v59.6,64.3 | R44.1 18.48,6.5 v17.5,6.5 | C44.2 23.83,6.57 v23.9,6.5 | R34.1 v87,24.7 | U11.11
  Top 0.2: Y2.2 v63.89,86.39 v63.9,86.4 | R6.1 67.18,84.34 U15.65 | U$13.2 25.04,18.64 v25.1,18.7 | U$13.5 25.1,14.67 v25.1,13.5 | C5.2 59.12,33.7 58.73,34.1 | v66.5,38.4 67.97,38.4 | C21.2 66.5,37.67 v66.5,38.4 | v66.5,38.4 70.3,38.4 71.8,36.9 C23.2 | C22.2 68.92,36.77 67.8,37.9 67,37.9 v66.5,38.4 | R3.1 v63.4,15.7
  Top 0.203: C30.2 53.56,74.44 v53,75 | C20.2 45.91,38.59 v45,39.5 | U13.5 46.5,38.35 v46.5,39
  Top 0.406: 55.61,15.5 v57.4,15.5 | 8.8,18.89 v8.8,17.1 | 82.4,17.21 v82.4,19 | 33.41,16.1 v35.2,16.1 | 5.11,33.8 v6.9,33.8 | U7.9 25.61,52.11 v26,52.5 | C41.2 58.88,34.1 v58.8,34.1 | C42.2 v58.8,34.1 | C43.2 58.73,34.1 v58.8,34.1
  other vias: 50.5,65.9 53.8,67.9 50.4,67.8 52.5,69.9 50.4,72.8 54.8,72.1 63.3,36.3 19.95,12.63
  pour Top: 58.2,72.2 55.9,72.2 55,71.3 55,68.6 54.3,67.9 54.3,67.2 53.9,66.8 53.9,65.8 52.9,64.8 50.5,64.8 49.3,66 49.3,72.8 50.1,73.6 58.4,73.6 58.4,72.4
  pour GND: -0.2,-0.2 -0.2,91 0,91.2 91.1,91.2 91.4,90.9 91.4,0.2 91,-0.2
  cutout GND: 88,63 88,62 47,62 47,62.5 47,63
  cutout GND: 44,62 3,62 3,63 43.5,63 44,63
  pour Bottom: -0.8,91.1 -0.3,91.6 -0.2,91.6 91,91.6 91.3,91.3 91.9,90.7 91.9,89.4 91.9,0 91.7,-0.2 91,-0.9 85.1,-0.9 -0.3,-0.9 -0.8,-0.4
  pour Top (rank 2): -0.5,91.4 91.1,91.4 91.6,90.9 91.6,0.2 90.8,-0.6 -0.1,-0.6 -0.4,-0.3 -0.4,91.1 -0.5,91.2
  cutout GND: 46.7,6.2 46.7,59.4 44.9,59.4 44.8,59.3 44.8,6.2
  cutout GND: 42.3,58.9 37.9,54.5 37.9,45.7 33.7,41.5 33.7,35.7 33.7,29 31.1,26.4 16.3,11.6 16.3,9.8 16.3,-1.7 17,-1.7 17,11.3 17.7,12 34.4,28.7 34.4,29.6 34.4,41.3 35.1,42 38.4,45.3 38.4,46.5 38.4,54.3 42.7,58.6 42.4,58.9
  cutout GND: -3.2,21.5 7.7,21.5 12.9,26.7 25.2,39 25.2,41.7 25.2,47.4 29.4,51.6 37.9,60.1 38.1,60.1 38.4,59.8 25.9,47.3 25.9,38.9 24.4,37.4 8.1,21.1 6.9,21.1 -3.2,21.1
  cutout GND: -2.5,42.4 8.7,42.4 20.7,54.4 27.4,54.4 33.7,60.7 33.9,60.7 34.2,60.4 34.2,60.3 33.7,59.8 27.8,53.9 21,53.9 9.1,42 -2.1,42
  cutout GND: 85,-1.8 85,8.6 85,11 67.5,28.5 67.5,44.9 52,60.4 51.8,60.4 51.5,60.1 51.5,60 66.9,44.6 66.9,44 66.9,28.5 68.2,27.2 84.5,10.9 84.5,10.4 84.5,-1.3
GPS-3V3-
  Top 0.152: R48.2 21.95,12.63 C45.1 | R49.1 23.54,15.29 U$13.4 | 20.86,11.2 20.94,11.11 U14.2 U14.3
  Top 1.016: C45.1 21.5,11.91 20.86,11.27 20.86,11.2 21.18,11.2
  Top 1.27: R49.1 C45.1
GPS-3V3-ADC  (via drill 0.35)
  Top 0.152: U15.5 58.38,76.82 v59.4,75.8 | v25.9,19.5 25.9,17.66 U$13.1 | v35.1,19.8 v38.4,19.8 | v34.6,42.3 27.3,35 v27.3,28.9 | v27.4,24.8 27.4,21 v25.9,19.5 | v32.7,20.3 32.4,20 27.4,20 26.81,19.41 26.65,19.41 26.64,19.4 26,19.4 v25.9,19.5
  POWER 0.152: v59.4,75.8 65.19,70.01 65.95,70.01 66.31,69.65 66.31,69.15 65.8,68.64 65.8,68 63.71,65.91 63.55,65.91 39.94,42.3 v34.6,42.3
  Bottom 0.152: v32.7,20.3 34.6,20.3 v35.1,19.8 | v38.4,19.8 46.94,19.8 U$21.20 | v27.3,28.9 27.3,24.9 v27.4,24.8
  other vias: 47.5,20.36
GPS-3V3-EN  (via drill 0.35)
  Top 0.152: U14.4 19.93,11 v18.2,11 18.2,14.64 19.01,15.45 19.01,18.36 17.2,20.16 v17.2,24.9 | U15.32 65.06,67.56 65.06,68.12 64.5,68.68 v64.5,69.8 | v49.9,19.6 49.39,19.09 U$21.19 | v33.1,43.6 17.4,27.9 v17.2,27.9
  POWER 0.152: v64.5,69.8 59.61,64.91 59.35,64.91 38.04,43.6 v33.1,43.6
  Bottom 0.152: v17.2,27.9 v17.2,24.9 | v49.9,19.6 36.51,32.99 36.45,32.99 33.1,36.34 v33.1,43.6
MAIN-POWER-BUS  (via drill 0.35)
  Top 0.152: C17.1 39.49,50.09 39.5,50.1 | R23.2 59.42,54.5 56.2,54.5 54.7,53 54.7,47.48 | v43.3,67.4 43.3,65.2 45.7,62.8 45.7,50.61 U10.2 43.94,50.24 43.7,50 43.3,50 43.2,50.1 | v43.3,70.1 43.3,74.27 33.38,84.19 33.27,84.3 33.27,84.83 33.13,84.97 32.6,84.97 U$20.9
  Top 0.508: U9.3 37.99,50.1 39.5,50.1 43.2,50.1
  Top 0.61: U9.2 37.99,50.1
  Top 1.016: 54.7,47.48 U$2.1 U$2.2 | U$2.2 U$2.3 | U$24.1 58.97,46.87 U$2.2
  Top 1.27: U10.2 46.7,49.61 46.7,48.5 47.72,47.48
  Top 2.54: 47.72,47.48 54.7,47.48
  Bottom 0.152: v43.3,70.1 v43.3,67.4
MSP_OBC_RESET  (via drill 0.35)
  Top 0.152: U$22.2 78.82,74.08 v78.8,74.1 | v44.8,79.8 44.8,78.6 44.5,78.3
  Top 0.2: Q1.1 44.5,78.3 42.89,78.3 R36.2
  Bottom 0.152: v78.8,74.1 74.36,74.1 73.95,73.69 68.77,73.69 63.05,79.41 45.19,79.41 v44.8,79.8
N$1
  Top 0.152: R5.2 54.55,12.33 U2.5
N$2  (via drill 0.35)
  Top 0.152: U16.3 30,70.92 R31.1 31.79,69.55 32.5,68.83 43.27,68.83 47.3,64.8 48.5,64.8 57.1,56.2 v57.1,55.11 | v66.4,45.6 68.48,45.6 U$4.4
  Bottom 0.152: v57.1,55.11 66.4,45.81 v66.4,45.6
N$3
  Top 0.152: C15.1 30.91,56.59 30.8,56.7
  Top 0.61: U7.6 U7.7 28.5,50.27 | U9.7 U9.6 35.07,50.27 33.9,50.27
  Top 1.27: U8.3 15.39,62.9 25.9,62.9 30.8,58 | 30.8,58 32.02,59.22 U10.3 | 33.9,50.27 30.8,50.27 28.5,50.27 | 30.8,56.7 30.8,58
  Top 2.54: 30.8,50.27 30.8,56.7
N$4
  Top 0.152: R23.1 62.31,57.26 R27.1 62.35,56.87 63.07,56.16 63.07,49.63 64.2,48.5 67.48,48.5 U$3.4 67.54,46.72 63.06,46.72 62.3,47.48 U$2.4
  Top 0.305: U$7.1 63.45,59.15 61.04,57.74 R23.1
N$5
  Top 0.152: R10.2 5.63,19.95 U3.5
N$6
  Top 0.152: R26.2 85.57,16.14 U4.5
N$7
  Top 0.152: R39.2 32.34,12.93 U5.5
N$9
  Top 0.152: R45.2 4.04,30.63 U17.5
N$10
  Top 0.2: U2.8 57.22,14.01 57.54,14.33 57.92,14.33 58.29,14.71 58.3,14.71 | 58.3,14.71 R7.1 | R2.2 58.3,14.71
N$11
  Top 0.152: R8.2 85.81,20.97 84.53,19.69 84.53,18.27 84.34,18.08 84.06,18.08 84.05,18.09 U4.8 83.89,18.25 83.87,18.27 83.87,19.21 R37.1
N$12
  Top 0.152: U11.2 63.88,37.7
  Top 0.61: 63.88,37.7 U11.1 64.3,38.7
  Top 1.016: L1.1 64.76,39.16 64.3,38.7
N$13
  Top 0.2: C5.1 62.3,34.12 U11.6
N$14
  Top 0.152: R44.2 20.14,8.21 U14.5
N$15  (via drill 0.35)
  Top 0.152: v27.7,51.9 27.7,51.6 U7.8 | R13.2 23.51,48.97 U7.4 24.3,48.88 v24.3,48.1 23.05,46.85 C13.1
  Bottom 0.152: v24.3,48.1 26.6,50.4 26.6,51.4 27.1,51.9 v27.7,51.9
N$17  (via drill 0.35)
  Top 0.152: U12.5 36.7,71.55 R28.2 36.8,69.93 | 38.9,69.93 C1.1 | C1.1 39.12,69.7 | U$3.7 65.86,52.3 | 65.86,52.3 65.86,51.73 66.3,51.3 67.14,52.13 67.14,52.5 | R31.2 34.23,69.55 34.57,69.21 36.08,69.21 36.8,69.93 | C1.1 37.01,69.72 36.8,69.93 | C1.1 42.82,69.72 47.25,65.29 49.01,65.29 v58.8,55.5 | v64.6,55.5 U$3.8 64.7,53.32 64.7,52.5 64.9,52.3 65.86,52.3 | U$4.2 U$4.1 | U$3.5 68.41,52.91 68,52.5 67.14,52.5 | U$3.6 67.14,52.5
  Top 1.27: U$4.1 U$4.3 | U$4.2 71.64,51.3 66.3,51.3 66.3,51.4
  Bottom 0.152: v58.8,55.5 v64.6,55.5
N$18
  Top 0.152: U7.5 27.32,48.97 R14.2
N$19  (via drill 0.35)
  Top 0.152: 35.19,45.91 C14.1 35.1,47.52 R15.2 35.08,48.97 U9.8 34.38,49.09 v34.2,48.9 | v38.7,51.7 38.03,51.03 U9.4
  Bottom 0.152: v34.2,48.9 37,51.7 v38.7,51.7
N$21
  Top 0.152: R16.2 34.6,51.62 U9.5
N$22
  Top 0.152: 59.1,49.6 58.9,49.8 58.4,50.3 | R27.2 62.35,54.77 U$2.5 60.9,52.7 60.3,52.1 59.63,52.1 | U$2.6 59.63,52.1 | 59.63,52.1 59.63,51.94 59.3,51.6 | U$3.2 U$3.3 | U$2.7 58.37,52.4 | 58.37,52.4 58.37,51.66 58.3,51.6 | 59.63,52.1 59.13,51.6 58.5,51.6 | 57.5,52.4 57.2,52.7 57.2,53.22 U$2.8 | 57.5,52.4 58.37,52.4 | 57.5,52.4 58.3,51.6 | 58.3,51.6 58.5,51.6 | 61.2,49.8 60.1,50.9 59.1,50.9 58.5,51.5 58.5,51.6
  Top 1.27: U$3.3 U$3.1 63.42,47.58 61.2,49.8 58.9,49.8
N$24
  Top 0.152: R29.2 33.95,71.05 R28.1 35.84,70.7 U12.4
N$25
  Top 0.152: R30.1 35.51,74.14 U12.3
N$26
  Top 0.152: U12.6 38.4,72.3 38.4,75.4 38.3,75.5 34.23,75.5 R30.2 30.99,75.78 30.95,75.81 | U16.1 30.95,75.81 | 30.95,75.81 30.83,75.93 R32.2
N$30
  Top 0.152: U13.6 48.4,34.6 | U$5.2 48.17,32.08 48.7,32.6
  Top 0.305: 48.7,32.6 48.4,32.9 48.4,34.6
N$31
  Top 0.203: U13.2 48.65,39.41 R33.2
OBC-3V3-
  Top 0.152: U$10.4 14.29,17.26 R12.1 | C8.1 | 10.26,18.5 U3.2 | R11.2 10.8,17.21 10.8,18.5
  Top 0.305: C8.1 10.8,18.5 10.26,18.5
  Top 0.61: R12.1 C8.1 | U3.2 U3.3
OBC-3V3-ADC  (via drill 0.35)
  Top 0.152: U15.2 57.78,78.3 51.9,78.3 47.5,73.9 v47.5,65.9 | v15.2,15.6 15.99,14.81 U$10.1 | U$21.5 43.14,15.94 42.6,15.94 41.39,17.16 41.39,25.81 41.1,26.1 14.53,26.1 13.67,25.23 v13.88,25.02
  Bottom 0.152: v47.5,65.9 15.2,33.6 v15.2,15.6 13.88,16.92 v13.88,25.02
OBC-3V3-EN  (via drill 0.35)
  Top 0.152: U15.29 63.68,65.42 v63.8,65.3 | U3.4 10.2,20.05 v10.2,22.2 14.6,26.6 41.27,26.6 41.27,26.59 41.5,26.59 41.7,26.4 41.7,17.87 42.36,17.21 43.14,17.21 U$21.4
  Bottom 0.152: v63.8,65.3 62.59,66.51 46.41,66.51 10.2,30.3 v10.2,22.2
OBC-5V-
  Top 0.152: U$8.4 57.24,20.98 R9.1 | C3.1 | 55.99,16.96 U2.2 | R7.2 57.28,17.5 55.99,17.5
  Top 0.305: C3.1 55.99,17.5 55.99,16.96
  Top 0.61: R9.1 C3.1 | U2.2 U2.3
OBC-5V-ADC  (via drill 0.35)
  Top 0.152: U15.1 57.82,78.8 v59.2,78.8 | U$21.14 47.56,12.8 49.6,12.8 52.3,10.1 v52.3,9.49
  Top 0.2: v58.8,21.8 59.69,22.69 U$8.1
  Bottom 0.152: v52.3,9.49 52.6,9.79 54.75,9.79 58.8,13.84 v58.8,21.8 58.8,22.4 53.81,27.39 53.81,55.31 54.3,55.8 58,55.8 58.8,56.6
  Bottom 0.2: v59.2,78.8 67,71 67,64.8 58.8,56.6
OBC-5V-EN  (via drill 0.35)
  Top 0.152: U$21.13 49.47,11.47 v49.5,11.5 | 62.15,64.15 65.39,64.15 69.8,59.74 74.14,59.74 74.27,59.87 74.27,61.17 v79.3,66.2
  Top 0.2: v56.7,61 56.7,61.1 59.1,61.1 62.15,64.15 63.17,65.17 63.17,65.56 63.18,65.57 U15.28 | v53.4,16.8 v53.41,16.81 U2.4
  Bottom 0.152: v49.5,11.5 53.4,15.4 v53.4,16.8 52.69,17.51 52.69,18.55 53.2,19.06 53.2,60.5 53.7,61 v56.7,61 | J5.5 76.85,80.6 81.9,80.6 82.7,79.8 82.7,69.6 v79.3,66.2
P4.4/UCA1TXD  (via drill 0.35)
  Top 0.152: v69.2,76.1 69.6,74.8 70.1,74.3 U15.51
  Bottom 0.152: J5.7 66.23,82.81 66.27,82.81 66.63,82.45 66.63,78.67 v69.2,76.1
P4.5/UCA1RXD  (via drill 0.35)
  Top 0.152: U15.52 70.94,74.94 70.38,74.94 70.2,75.12 70.2,75.96 v68.5,77.9
  Bottom 0.152: J5.6 68.5,86.41 v68.5,77.9
P5.2/XT2IN1
  Top 0.2: Y2.3 65.39,81.5 65.28,81.39 65.28,80.8 U15.69
P5.3/XT2OUT1
  Top 0.2: Y2.1 63.24,83.56 63.24,83 64.68,81.56 U15.70
P5.4/XIN1
  Top 0.2: C29.2 50.54,71.79 Y1.P2
  Top 0.203: Y1.P2 52.29,73.54 52.29,73.91 52.44,74.06 53.28,74.06 54.02,73.32 U15.12
P5.5/XOUT1
  Top 0.2: C28.2 54.16,71.87 Y1.P1
  Top 0.203: Y1.P1 53.63,73.17 53.98,72.82 U15.13
PACK-IN  (via drill 0.35)
  Top 0.152: U1.4 7.1,74.85 | 7.1,74.85 U1.3 | U8.2 14.83,54.13 | 6.35,74.85 U1.4 | U$25.1 5.5,67.07 | U$25.1 5.37,66.44 | 6.4,66.67 U$25.1 | v23.24,74.16 21.88,72.8 U$1.8 | U$25.1 6,73.75 7.1,74.85 | U1.4 10.03,77.85 R17.2 11.4,79.65 C18.1 13.39,81.64 13.39,82.75 17.54,86.9 U$20.1
  Top 0.406: C16.1 22.53,49.9 | U8.2 18.58,50.72 19.4,49.9
  Top 0.508: U7.2 24.21,49.9 U7.3
  Top 0.813: 24.21,49.9 22.53,49.9
  Top 1.016: 19.4,49.9 22.53,49.9
  Top 1.27: U$25.1 6,59.55 U8.2
  Bottom 0.152: U$25.1 11.81,67.07 11.95,67.21 16.29,67.21 v23.24,74.16
RESERVED1
  Top 0.152: U$22.4 71.09,75.35 U15.53
RESERVED2
  Top 0.152: U$22.5 82.46,76.62 81.84,76 72.89,76 72.7,75.8 71.08,75.8 U15.54
RESERVED3
  Top 0.152: U$22.6 73.32,76.62 73,76.3 71.08,76.3 U15.55
RESERVED4
  Top 0.152: U$22.7 82.46,77.89 81.86,77.28 73.48,77.28 73,76.8 71.08,76.8 U15.56
RESERVED5
  Top 0.152: U$22.8 73.62,77.89 73.05,77.32 U15.57
RESERVED6
  Top 0.152: U$22.9 82.46,79.16 81.86,78.55 73.85,78.55 73.12,77.82 U15.58
RESERVED7
  Top 0.152: U$22.10 73.66,79.16 72.8,78.3 71.08,78.3 U15.59
RF-3V3-
  Top 0.152: U$14.4 6.84,38.19 R47.1 5.5,38.08 | C40.1 | 5.5,35.26 U17.2 | R46.2 7.38,35.8 5.5,35.8
  Top 0.305: C40.1 5.5,35.8 5.5,35.26
  Top 0.61: U17.2 U17.3 | C40.1 5.5,38.08
RF-3V3-ADC  (via drill 0.35)
  Top 0.152: U15.6 56.68,76.32 v56.3,76.7 | v8.8,39.2 8.8,39.81 8.82,39.83 8.82,40 U$14.1 | U$21.11 47.47,8.9 v45.8,8.9 | v16.4,33.4 12.81,36.99 12.81,39.95 10.45,42.31 7.89,42.31 v7.8,42.4
  Bottom 0.152: v56.3,76.7 53.96,76.7 53.75,76.91 46.51,76.91 v8.8,39.2 7.8,40.2 v7.8,42.4 | v16.4,33.4 28.27,21.53 28.27,17.56 32.14,13.69 36.16,13.69 36.71,13.15 36.71,12.63 40.44,8.9 43.7,8.9 v45.8,8.9
RF-3V3-EN  (via drill 0.35)
  Top 0.152: U15.33 65.68,69.38 v65.7,69.4 | v3.2,35 3.31,35.11 U17.4 | U$21.10 39.87,8.93 38.5,10.3 v35.4,10.3
  Bottom 0.152: v65.7,69.4 65.16,69.4 63.95,68.19 62.15,68.19 61.39,68.95 61.39,69.38 55.83,74.93 53.79,74.93 53.25,74.39 52.75,74.39 50.84,76.3 47.03,76.3 9.71,38.98 9.71,33.75 7.45,31.49 6.95,31.49 3.44,35 v3.2,35 2.9,34.7 2.9,17.5 10.1,10.3 v35.4,10.3
RST/SBWTDIO
  Top 0.152: C25.1 48.09,78.79 49.28,77.6 | R1.1 53.64,81.8 61.5,81.8 61.68,81.62 | 61.68,81.62 U15.76 | J5.8 61.68,81.62
  Top 0.2: 49.09,77.44 R1.1 49.28,77.6 49.28,81.99 S1.2 S1.1 | 47.74,78.79 C25.1 47.24,78 Q1.3
TARGET_PUR
  Top 0.2: U15.63 68.28,80.8 68.28,81.39 68.86,81.97 R6.2
TEST/SBWTCK  (via drill 0.35)
  Top 0.152: v64.2,79.4 U15.71
  Bottom 0.152: J5.9 v64.2,79.4
UCA0RXD
  Top 0.152: U$22.3 83.7,74.69 83.17,74.69 77.8,69.32 U15.41
UCA0TXD
  Top 0.152: U$22.1 77.72,67.44 U15.40
UCB0CLK
  Top 0.152: U$23.1 73,61.75 73,64.56 72.86,64.69 70.87,64.69 68.68,66.88 U15.39
UCB0SCL
  Top 0.152: U$23.2 72.23,63.5 69.7,63.5 69.11,64.09 69.11,64.68 68.18,65.61 U15.38
UCB0SDA
  Top 0.152: U$23.3 68.81,63.4 68.81,64.55 67.68,65.68 U15.37
VCORE1
  Top 0.203: U15.20 57.8,68.13 C26.2
VOLTAGE-REGULATOR-INPUT
  Top 0.152: 75.35,51.15 75.73,51.53 76.4,51.53 U$4.7 75.39,51.53 75.35,51.5 | 75.35,51.15 75.2,51 75.94,50.27 | U$4.8 77.62,52.7 76.4,52.7 75.35,51.65 75.35,51.5 | 75.35,51.5 75.35,51.15 | U$4.6 75.94,50.27 | U$4.5 77.2,48.99 75.94,50.27 | 75.28,47.84 75.28,50.42
  Top 0.2: U11.9 U11.10 67.08,34.9 C21.1
  Top 0.406: L1.2 69.4,41.2 | C21.1 C22.1 C23.1 73.22,35.23 73.4,35.4 73.4,37.6 71.4,39.6
  Top 1.27: 76.4,51.53 75.28,50.42 74.8,49.94
  pour Top: 73.7,53.1 73.7,48.4 73.5,48.2 68.3,43 66.8,43 66.8,39.6 67.6,38.8 70.9,38.8 71.1,39 76.7,44.6 77,44.6 77,53.4 76.9,53.5 73.8,53.5 73.7,53.4

## Text on the board
tPlace: Pack-In | GND | MAIN-POWER-BUS | 5V-REF | 0.933V-REF | CHARGE-OK | 1.4-REF | DISCHARGE-OK | BAT-DIV-3 | NC | Inhibit Switches. / Short pins to remove inhibit. | GND | SOLAR-ARRAY-IN | 5v0 | GPS-3V3-ADC | 3v3 | GPS-3V3-EN | !OBC-3V3-FAULT | !GPS-3V3-FAULT | OBC-3V3-EN | ADCS-5V-ADC | OBC-3V3-ADC | ADCS-5V-EN | !ADCS-3V3-FAULT | !ADCS-5V-FAULT | ADCS-3V3-EN | OBC-5V-ADC | ADCS-3V3-ADC | OBC-5V-EN | !RF-3V3-FAULT | !OBC-5V-FAULT | RF-3V3-EN | RF-3V3-ADC